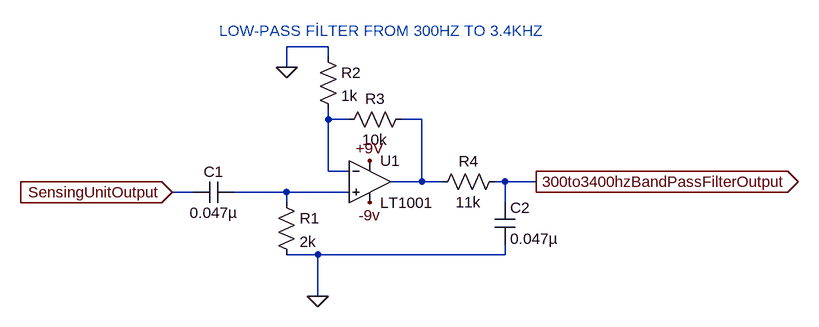
[diagram p0: schematic 6-active Low pass filter.asc]
6-active Low pass filter.asc, the LTspice schematic file:
Version 4
SHEET 1 1076 680
WIRE 304 -96 240 -96
WIRE 304 -80 304 -96
WIRE 240 -64 240 -96
WIRE 304 16 304 0
WIRE 336 16 304 16
WIRE 448 16 416 16
WIRE 304 96 304 16
WIRE 336 96 304 96
WIRE 448 112 448 16
WIRE 448 112 400 112
WIRE 480 112 448 112
WIRE 576 112 560 112
WIRE 624 112 576 112
WIRE 96 128 64 128
WIRE 240 128 160 128
WIRE 336 128 240 128
WIRE 240 144 240 128
WIRE 576 144 576 112
WIRE 288 224 240 224
WIRE 576 224 576 208
WIRE 576 224 288 224
WIRE 288 288 288 224
FLAG 240 -64 0
FLAG 288 288 0
FLAG 368 80 +9V
FLAG 368 144 -9v
FLAG 64 128 SensingUnitOutput
IOPIN 64 128 In
FLAG 624 112 300to3400hzBandPassFilterOutput
IOPIN 624 112 Out
SYMBOL cap 160 112 R90
WINDOW 0 0 32 VBottom 2
WINDOW 3 32 32 VTop 2
SYMATTR InstName C1
SYMATTR Value 0.047µ
SYMBOL res 224 128 R0
SYMATTR InstName R1
SYMATTR Value 2k
SYMBOL Opamps\\LT1001 368 48 R0
SYMATTR InstName U1
SYMBOL res 288 -96 R0
SYMATTR InstName R2
SYMATTR Value 1k
SYMBOL res 432 0 R90
WINDOW 0 0 56 VBottom 2
WINDOW 3 32 56 VTop 2
SYMATTR InstName R3
SYMATTR Value 10k
SYMBOL res 576 96 R90
WINDOW 0 0 56 VBottom 2
WINDOW 3 32 56 VTop 2
SYMATTR InstName R4
SYMATTR Value 11k
SYMBOL cap 560 144 R0
SYMATTR InstName C2
SYMATTR Value 0.047µ
TEXT 136 -120 Left 2 ;LOW-PASS FİLTER FROM 300HZ TO 3.4KHZ

The netlist it stands for:
* 6-active Low pass filter.asc
C1 N003 SensingUnitOutput 0.047µ
R1 N003 0 2k
XU1 N003 N001 +9V -9v N002 LT1001  ; pins In+ In- V+ V- OUT
R2 0 N001 1k
R3 N002 N001 10k
R4 300to3400hzBandPassFilterOutput N002 11k
C2 300to3400hzBandPassFilterOutput 0 0.047µ
* LOW-PASS FİLTER FROM 300HZ TO 3.4KHZ
.lib LTC.lib
.backanno
.end